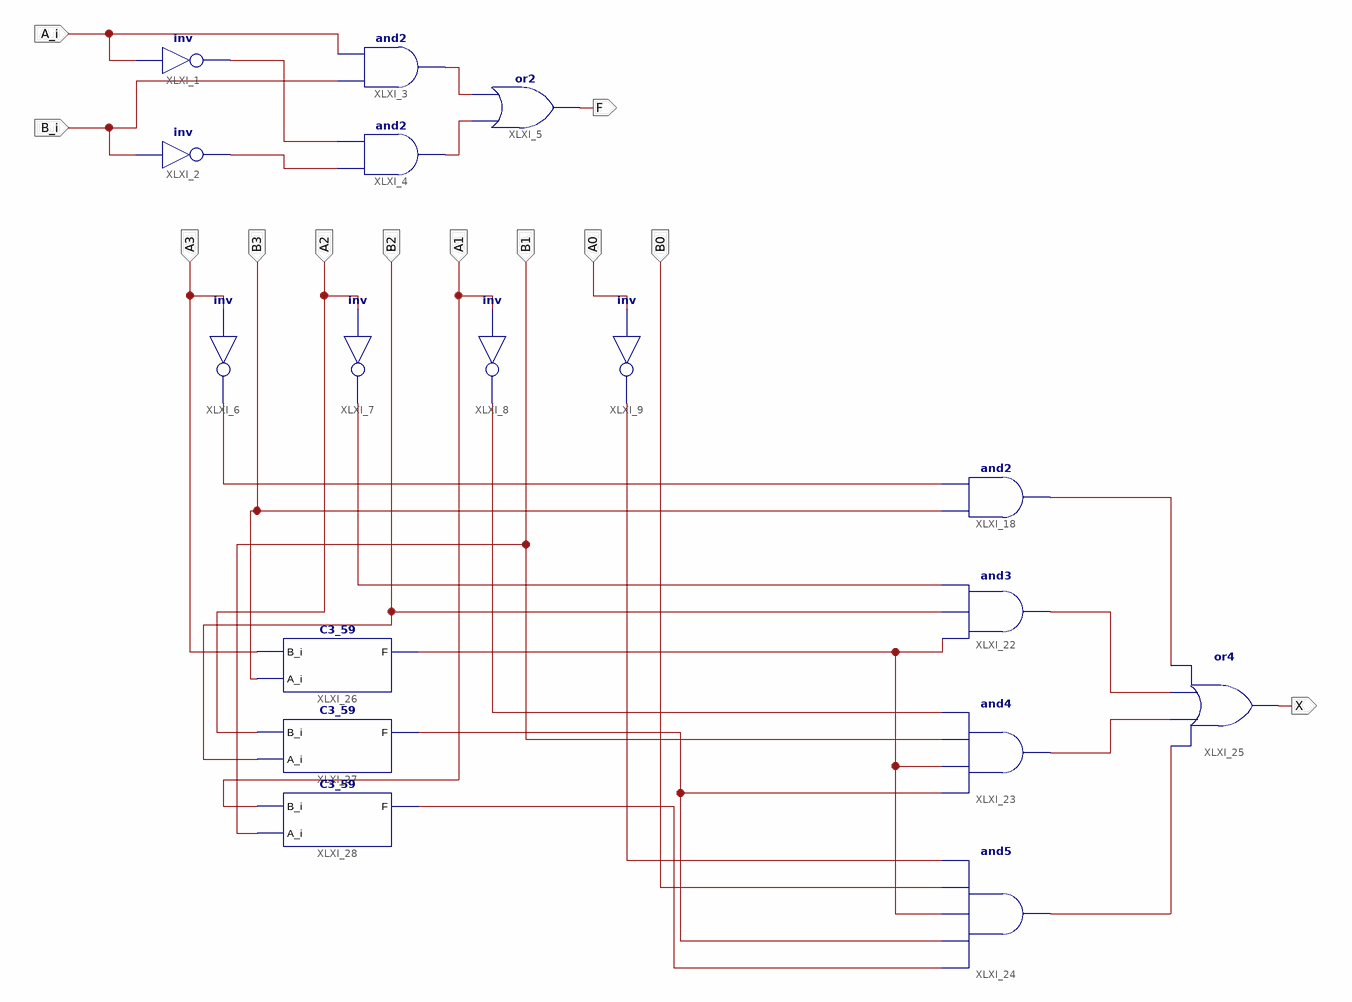
[diagram p0: schematic sheet 1]
// Xilinx ISE schematic C3_59.sch (kintex7) as structural Verilog: 17 symbols, 12 ports
module C3_59 (
  input  B_i,
  input  A_i,
  input  A3,
  input  B3,
  input  A2,
  input  B2,
  input  A1,
  input  B1,
  input  A0,
  input  B0,
  output F,
  output X
);

  wire XLXN_8, XLXN_9, XLXN_10, XLXN_11, XLXN_41, XLXN_42, XLXN_43, XLXN_44, XLXN_46, XLXN_49, XLXN_50,
       XLXN_52, XLXN_60, XLXN_62, XLXN_64;

  not XLXI_1 (XLXN_8, A_i);
  not XLXI_2 (XLXN_9, B_i);
  and XLXI_3 (XLXN_10, B_i, A_i);
  and XLXI_4 (XLXN_11, XLXN_9, XLXN_8);
  or XLXI_5 (F, XLXN_11, XLXN_10);
  not XLXI_6 (XLXN_46, A3);
  not XLXI_7 (XLXN_49, A2);
  not XLXI_8 (XLXN_50, A1);
  not XLXI_9 (XLXN_52, A0);
  and XLXI_18 (XLXN_41, B3, XLXN_46);
  and XLXI_22 (XLXN_42, XLXN_60, B2, XLXN_49);
  and XLXI_23 (XLXN_43, XLXN_62, XLXN_60, B1, XLXN_50);
  and XLXI_24 (XLXN_44, XLXN_64, XLXN_62, XLXN_60, B0, XLXN_52);
  or XLXI_25 (X, XLXN_44, XLXN_43, XLXN_42, XLXN_41);
  C3_59 XLXI_26 (.B_i(A3), .A_i(B3), .F(XLXN_60));
  C3_59 XLXI_27 (.B_i(A2), .A_i(B2), .F(XLXN_62));
  C3_59 XLXI_28 (.B_i(A1), .A_i(B1), .F(XLXN_64));
endmodule
